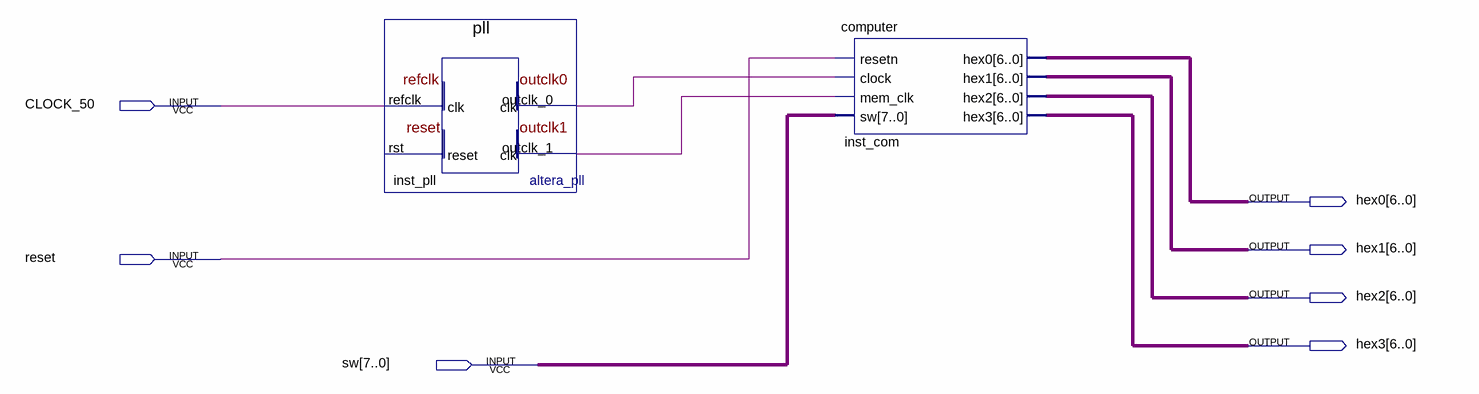
[diagram p0: schematic sheet]
// Quartus schematic sc_computer.bdf as structural Verilog: 2 symbols, 7 pins
module sc_computer (
  input  CLOCK_50,
  input  reset,
  input  [7:0] sw,
  output [6:0] hex0,
  output [6:0] hex1,
  output [6:0] hex2,
  output [6:0] hex3
);

  wire inst_pll_outclk_0, inst_pll_outclk_1;

  pll inst_pll (.refclk(CLOCK_50), .outclk_0(inst_pll_outclk_0), .outclk_1(inst_pll_outclk_1));  // open: rst
  computer inst_com (
    .resetn(reset), .clock(inst_pll_outclk_0), .mem_clk(inst_pll_outclk_1), .sw(sw), .hex0(hex0),
    .hex1(hex1), .hex2(hex2), .hex3(hex3));
endmodule
